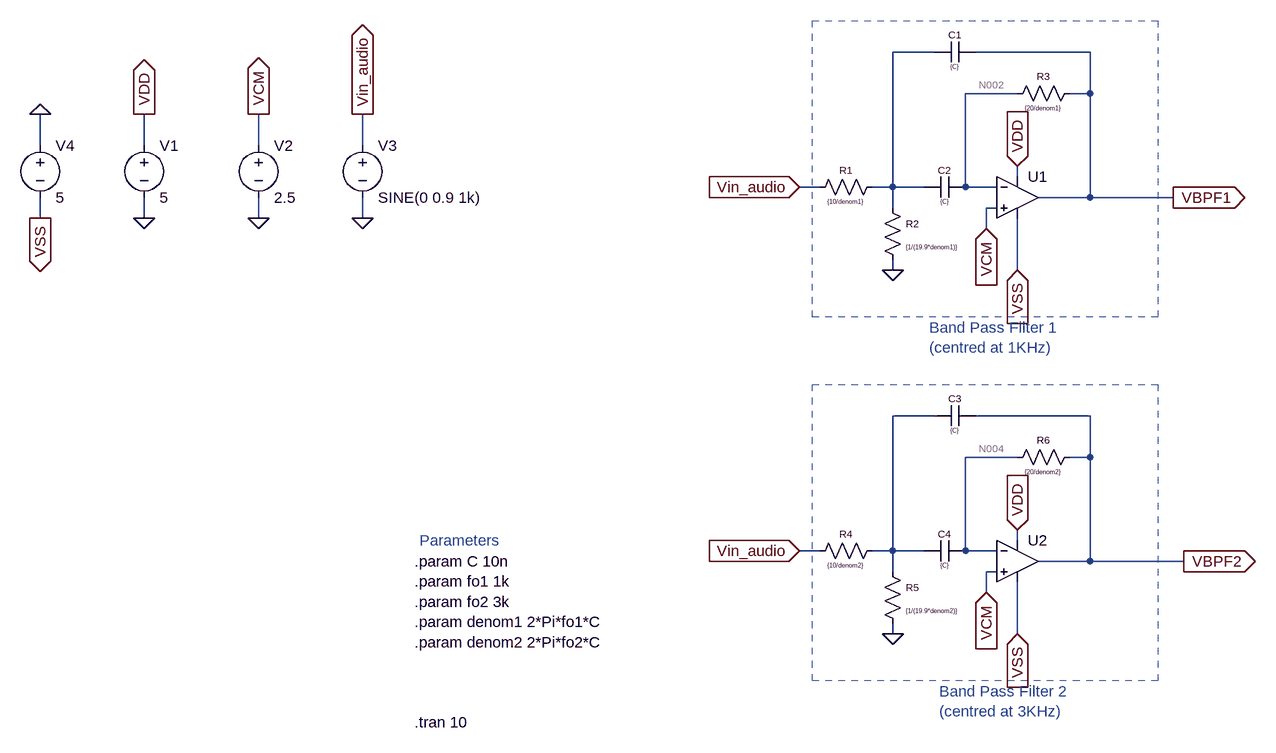
[diagram p0: schematic prelab6.asc]
prelab6.asc, the LTspice schematic file:
Version 4
SHEET 1 880 952
WIRE 272 -96 208 -96
WIRE 512 -96 336 -96
WIRE 400 -32 320 -32
WIRE 512 -32 512 -96
WIRE 512 -32 480 -32
WIRE -1104 48 -1104 0
WIRE -944 48 -944 0
WIRE -768 48 -768 0
WIRE -608 48 -608 0
WIRE 400 96 400 80
WIRE 96 112 64 112
WIRE 208 112 208 -96
WIRE 208 112 176 112
WIRE 256 112 208 112
WIRE 320 112 320 -32
WIRE 368 112 320 112
WIRE 512 128 512 -32
WIRE 512 128 432 128
WIRE 640 128 512 128
WIRE 208 144 208 112
WIRE 368 144 352 144
WIRE -1104 160 -1104 128
WIRE -944 160 -944 128
WIRE -768 160 -768 128
WIRE -608 160 -608 128
WIRE 352 176 352 144
WIRE 208 240 208 224
WIRE 400 240 400 160
WIRE 272 464 208 464
WIRE 512 464 336 464
WIRE 400 528 320 528
WIRE 512 528 512 464
WIRE 512 528 480 528
WIRE 400 656 400 640
WIRE 96 672 64 672
WIRE 208 672 208 464
WIRE 208 672 176 672
WIRE 256 672 208 672
WIRE 320 672 320 528
WIRE 368 672 320 672
WIRE 512 688 512 528
WIRE 512 688 432 688
WIRE 656 688 512 688
WIRE 208 704 208 672
WIRE 368 704 352 704
WIRE 352 736 352 704
WIRE 208 800 208 784
WIRE 400 800 400 720
FLAG 208 240 0
FLAG 400 240 VSS
IOPIN 400 240 In
FLAG 400 80 VDD
IOPIN 400 80 In
FLAG 64 112 Vin_audio
IOPIN 64 112 In
FLAG 208 800 0
FLAG 400 800 VSS
IOPIN 400 800 In
FLAG 400 640 VDD
IOPIN 400 640 In
FLAG 64 672 Vin_audio
IOPIN 64 672 In
FLAG 656 688 VBPF2
IOPIN 656 688 Out
FLAG 640 128 VBPF1
IOPIN 640 128 Out
FLAG 352 176 VCM
IOPIN 352 176 In
FLAG 352 736 VCM
IOPIN 352 736 In
FLAG -944 160 0
FLAG -768 160 0
FLAG -608 160 0
FLAG -944 0 VDD
IOPIN -944 0 Out
FLAG -768 0 VCM
IOPIN -768 0 Out
FLAG -608 0 Vin_audio
IOPIN -608 0 Out
FLAG -1104 0 0
FLAG -1104 160 VSS
IOPIN -1104 160 Out
SYMBOL res 192 96 R90
WINDOW 0 0 56 VBottom 1
WINDOW 3 32 56 VTop 0
SYMATTR InstName R1
SYMATTR Value {10/denom1}
SYMBOL res 192 128 R0
WINDOW 0 36 40 Left 1
WINDOW 3 36 76 Left 0
SYMATTR InstName R2
SYMATTR Value {1/(19.9*denom1)}
SYMBOL res 384 -16 R270
WINDOW 0 32 56 VTop 1
WINDOW 3 0 56 VBottom 0
SYMATTR InstName R3
SYMATTR Value {20/denom1}
SYMBOL cap 336 -112 R90
WINDOW 0 0 32 VBottom 1
WINDOW 3 32 32 VTop 0
SYMATTR InstName C1
SYMATTR Value {C}
SYMBOL cap 320 96 R90
WINDOW 0 0 32 VBottom 1
WINDOW 3 32 32 VTop 0
SYMATTR InstName C2
SYMATTR Value {C}
SYMBOL res 192 656 R90
WINDOW 0 0 56 VBottom 1
WINDOW 3 32 56 VTop 0
SYMATTR InstName R4
SYMATTR Value {10/denom2}
SYMBOL res 192 688 R0
WINDOW 0 36 40 Left 1
WINDOW 3 36 76 Left 0
SYMATTR InstName R5
SYMATTR Value {1/(19.9*denom2)}
SYMBOL res 384 544 R270
WINDOW 0 32 56 VTop 1
WINDOW 3 0 56 VBottom 0
SYMATTR InstName R6
SYMATTR Value {20/denom2}
SYMBOL cap 336 448 R90
WINDOW 0 0 32 VBottom 1
WINDOW 3 32 32 VTop 0
SYMATTR InstName C3
SYMATTR Value {C}
SYMBOL cap 320 656 R90
WINDOW 0 0 32 VBottom 1
WINDOW 3 32 32 VTop 0
SYMATTR InstName C4
SYMATTR Value {C}
SYMBOL OpAmps\\UniversalOpAmp1 400 128 R0
SYMATTR InstName U1
SYMBOL OpAmps\\UniversalOpAmp1 400 688 R0
SYMATTR InstName U2
SYMBOL voltage -944 32 R0
WINDOW 123 0 0 Left 0
WINDOW 39 0 0 Left 0
SYMATTR InstName V1
SYMATTR Value 5
SYMBOL voltage -768 32 R0
WINDOW 123 0 0 Left 0
WINDOW 39 0 0 Left 0
SYMATTR InstName V2
SYMATTR Value 2.5
SYMBOL voltage -608 32 R0
WINDOW 123 0 0 Left 0
WINDOW 39 0 0 Left 0
SYMATTR InstName V3
SYMATTR Value SINE(0 0.9 1k)
SYMBOL voltage -1104 32 R0
WINDOW 123 0 0 Left 0
WINDOW 39 0 0 Left 0
SYMATTR InstName V4
SYMATTR Value 5
TEXT 264 328 Left 2 ;Band Pass Filter 1\n(centred at 1KHz)
TEXT 280 888 Left 2 ;Band Pass Filter 2\n(centred at 3KHz)
TEXT -528 688 Left 2 !.param C 10n\n.param fo1 1k\n.param fo2 3k\n.param denom1 2*Pi*fo1*C\n.param denom2 2*Pi*fo2*C
TEXT -520 656 Left 2 ;Parameters
TEXT -528 936 Left 2 !.tran 10
RECTANGLE Normal 84 -144 616 312 2
RECTANGLE Normal 84 416 616 872 2

The netlist it stands for:
* prelab6.asc
R1 N001 Vin_audio {10/denom1}
R2 N001 0 {1/(19.9*denom1)}
R3 N002 VBPF1 {20/denom1}
C1 VBPF1 N001 {C}
C2 N002 N001 {C}
R4 N003 Vin_audio {10/denom2}
R5 N003 0 {1/(19.9*denom2)}
R6 N004 VBPF2 {20/denom2}
C3 VBPF2 N003 {C}
C4 N004 N003 {C}
XU1 VCM N002 VDD VSS VBPF1 level1 Avol=1Meg GBW=10Meg Vos=0 En=0 Enk=0 In=0 Ink=0 Rin=500Meg  ; pins In+ In- V+ V- OUT
XU2 VCM N004 VDD VSS VBPF2 level1 Avol=1Meg GBW=10Meg Vos=0 En=0 Enk=0 In=0 Ink=0 Rin=500Meg  ; pins In+ In- V+ V- OUT
V1 VDD 0 5
V2 VCM 0 2.5
V3 Vin_audio 0 SINE(0 0.9 1k)
V4 0 VSS 5
* Band Pass Filter 1
* (centred at 1KHz)
* Band Pass Filter 2
* (centred at 3KHz)
.param C 10n
.param fo1 1k
.param fo2 3k
.param denom1 2*Pi*fo1*C
.param denom2 2*Pi*fo2*C
* Parameters
.tran 10
.lib UniversalOpAmp1.lib
.backanno
.end

* Results of the author's LTspice run, read from the files saved beside the schematic
* Operating Point, zero values left out:
*   V(n002) = 2.5 V
*   V(vbpf1) = 2.502 V
*   V(n004) = 2.5 V
*   V(vbpf2) = 2.501 V
*   V(vcm) = 2.5 V
*   V(vdd) = 5 V
*   V(vss) = -5 V
*   I(R6) = -5 nA
*   I(R3) = -5 nA
*   I(V4) = -30 nA
*   I(V2) = -10 nA
*   I(V1) = -10 nA
*   Ix(u1:1) = 5 nA
*   Ix(u1:2) = 5 nA
*   Ix(u1:3) = 5 nA
*   Ix(u1:4) = -15 nA
*   Ix(u1:5) = -2.794 nA
*   Ix(u2:1) = 5 nA
*   Ix(u2:2) = 5 nA
*   Ix(u2:3) = 5 nA
*   Ix(u2:4) = -15 nA
*   Ix(u2:5) = -5.588 nA